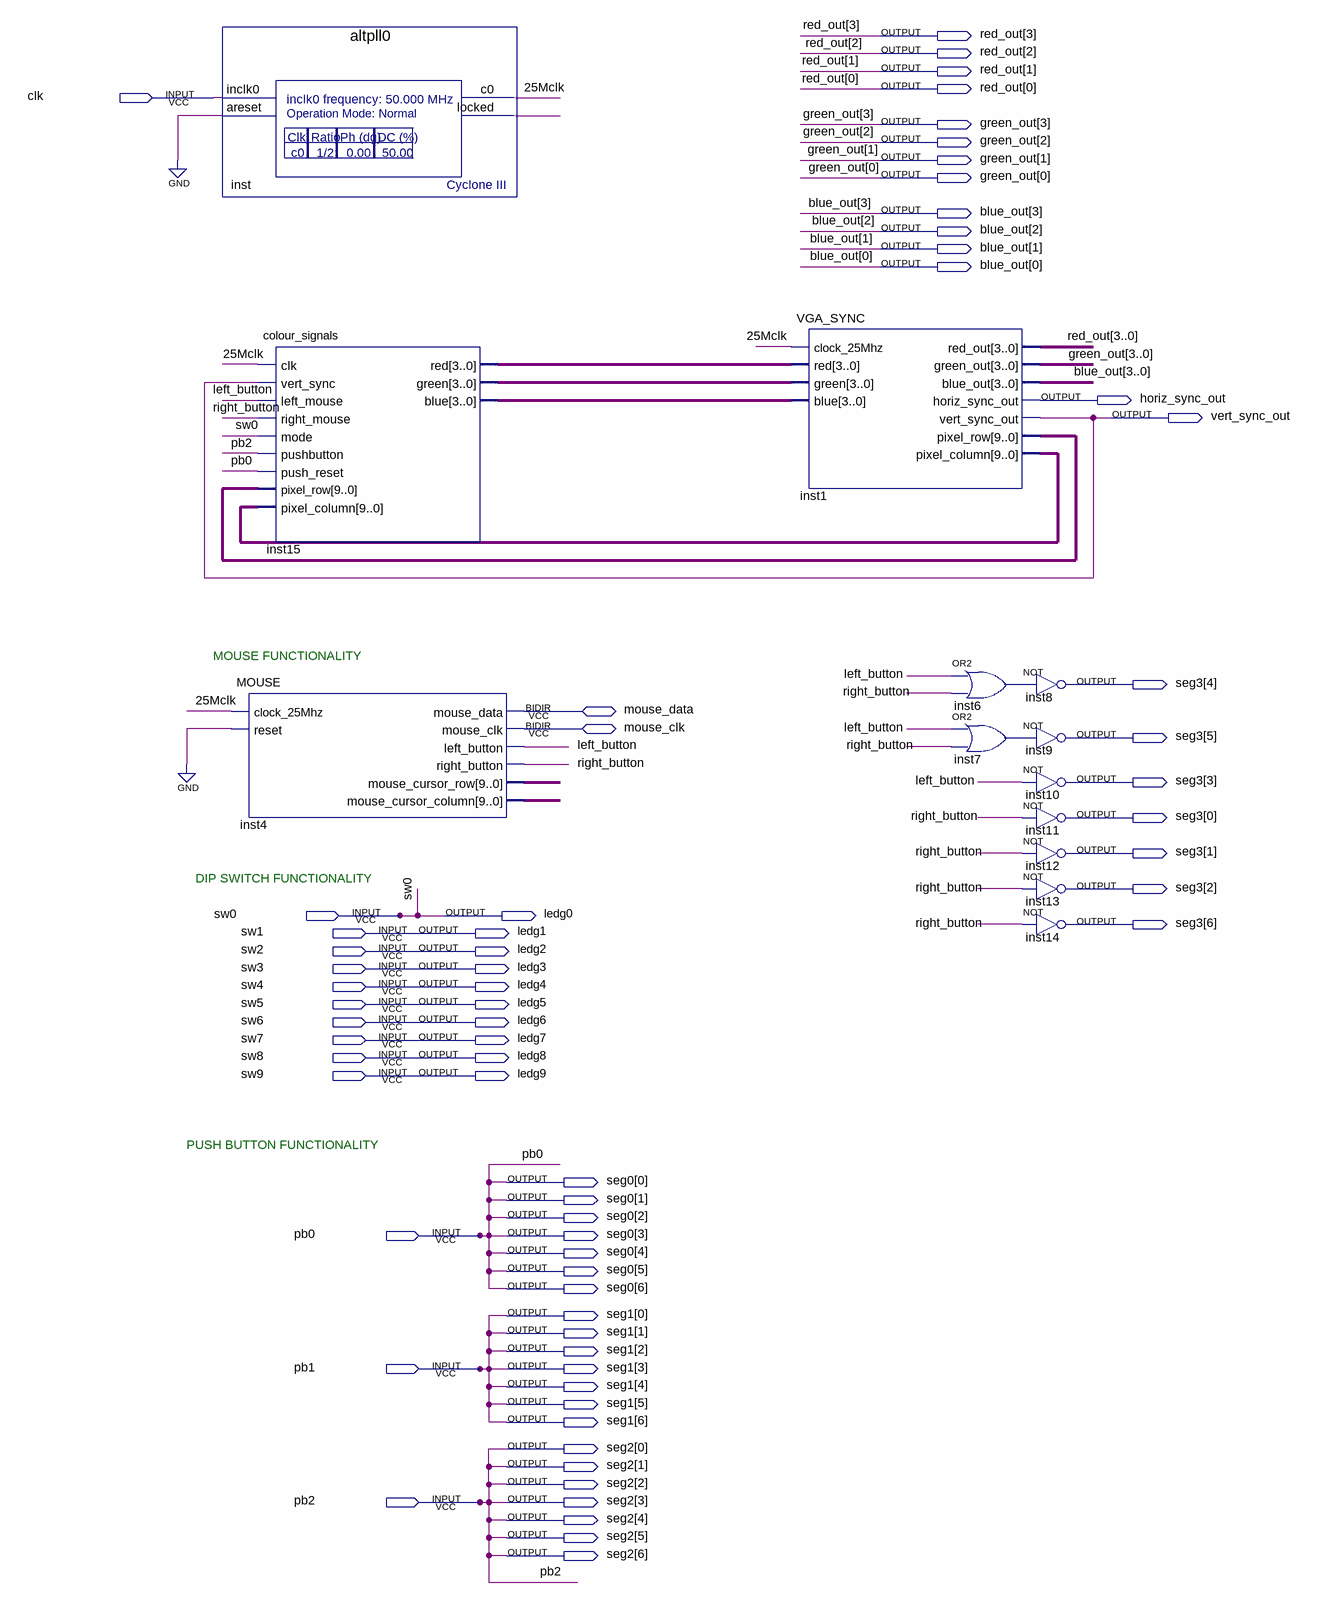
[diagram p0: schematic sheet]
// Quartus schematic Test.bdf as structural Verilog: 13 symbols, 68 pins
module Test (
  input  clk,
  input  sw0,
  input  sw1,
  input  sw2,
  input  sw3,
  input  sw4,
  input  sw5,
  input  sw6,
  input  sw7,
  input  sw8,
  input  sw9,
  input  pb0,
  input  pb1,
  input  pb2,
  inout  mouse_data,
  inout  mouse_clk,
  output [3:0] red_out,
  output [3:0] green_out,
  output [3:0] blue_out,
  output horiz_sync_out,
  output vert_sync_out,
  output [6:0] seg3,
  output ledg0,
  output ledg1,
  output ledg2,
  output ledg3,
  output ledg4,
  output ledg5,
  output ledg6,
  output ledg7,
  output ledg8,
  output ledg9,
  output [6:0] seg0,
  output [6:0] seg1,
  output [6:0] seg2
);

  wire \25Mclk , inst6_out, inst7_out, inst_locked, left_button, right_button;
  wire [3:0] inst15_blue, inst15_green, inst15_red;
  wire [9:0] inst1_pixel_column, inst1_pixel_row, inst4_mouse_cursor_column, inst4_mouse_cursor_row;

  altpll0 inst (.inclk0(clk), .areset(1'b0), .c0(\25Mclk ), .locked(inst_locked));
  colour_signals inst15 (
    .clk(\25Mclk ), .vert_sync(vert_sync_out), .left_mouse(left_button), .right_mouse(right_button),
    .mode(sw0), .pushbutton(pb2), .push_reset(pb0), .pixel_row(inst1_pixel_row),
    .pixel_column(inst1_pixel_column), .red(inst15_red), .green(inst15_green), .blue(inst15_blue));
  MOUSE inst4 (
    .clock_25Mhz(\25Mclk ), .reset(1'b0), .left_button(left_button), .right_button(right_button),
    .mouse_cursor_row(inst4_mouse_cursor_row), .mouse_cursor_column(inst4_mouse_cursor_column),
    .mouse_data(mouse_data), .mouse_clk(mouse_clk));
  VGA_SYNC inst1 (
    .clock_25Mhz(\25Mclk ), .red(inst15_red), .green(inst15_green), .blue(inst15_blue), .red_out(red_out),
    .green_out(green_out), .blue_out(blue_out), .horiz_sync_out(horiz_sync_out),
    .vert_sync_out(vert_sync_out), .pixel_row(inst1_pixel_row), .pixel_column(inst1_pixel_column));
  or inst6 (inst6_out, left_button, right_button);
  or inst7 (inst7_out, left_button, right_button);
  not inst8 (seg3[4], inst6_out);
  not inst9 (seg3[5], inst7_out);
  not inst10 (seg3[3], left_button);
  not inst11 (seg3[0], right_button);
  not inst12 (seg3[1], right_button);
  not inst13 (seg3[2], right_button);
  not inst14 (seg3[6], right_button);

  assign ledg0 = sw0;
  assign seg0 = {7{pb0}};
  assign seg1 = {7{pb1}};
  assign seg2 = {7{pb2}};

  // Notes on the sheet:
  //   MOUSE FUNCTIONALITY
  //   DIP SWITCH FUNCTIONALITY
  //   PUSH BUTTON FUNCTIONALITY
endmodule
